# Altium schematic sheet Schematic-sensor.SchDoc
size A4
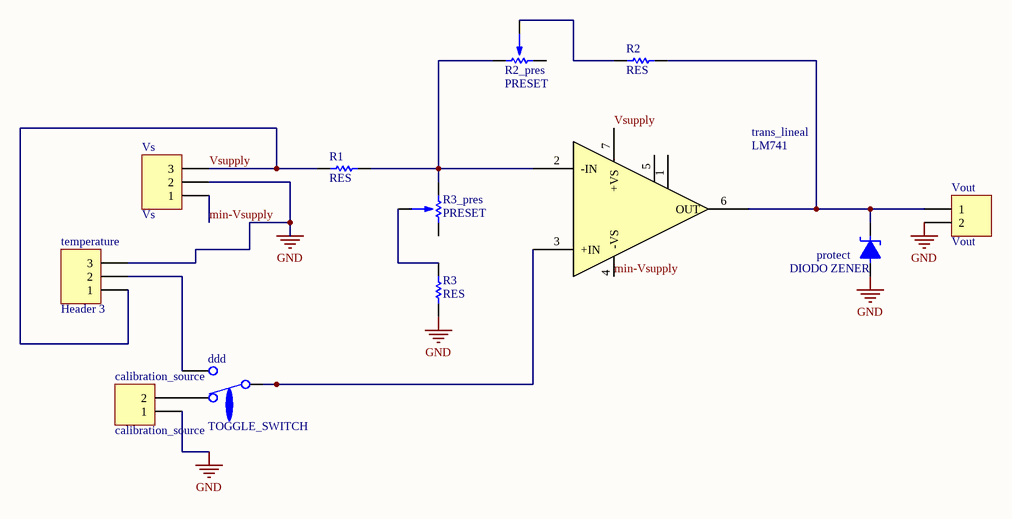
[diagram p0: Schematic-sensor.SchDoc]

## Parts
calibration_source  calibration_source  [HDR1X2]
ddd  TOGGLE_SWITCH  [TOOGLE SWITCH SIMPLE]
protect  DIODO ZENER  [DO41]
R1  RES  [RES400]
R2  RES  [RES400]
R2_pres  PRESET  [PRESET V]
R3  RES  [RES400]
R3_pres  PRESET  [PRESET V]
temperature  Header 3  [HDR1X3]
trans_lineal  LM741  [DIP8]
Vout  Vout  [HDR1X2]
Vs  Vs  [HDR1X3]

## Nets
GND: calibration_source.1 protect.1 R3.1 temperature.3 Vout.2 Vs.2
min-Vsupply: trans_lineal.4(-VS) Vs.1
Vsupply: R1.1 temperature.1 trans_lineal.7(+VS) Vs.3
Netcalibration_source_2: calibration_source.2 ddd.3(NC)
Netddd_1: ddd.1(NA) temperature.2
Netddd_2: ddd.2(C) trans_lineal.3(+IN)
Netprotect_2: protect.2 R2.2 trans_lineal.6(OUT) Vout.1
NetR1_2: R1.2 R2_pres.1 R3_pres.3 trans_lineal.2(-IN)
NetR2_1: R2.1 R2_pres.2
NetR3_2: R3.2 R3_pres.2

Not connected (* = marked no-connect by the designer): R2_pres 3; R3_pres 1; trans_lineal 1(-RG) 5(+RG)

## Library data of the parts
calibration_source Vout = Header 2: Header, 2-Pin; LatestRevisionDate: 17-Jul-2002; LatestRevisionNote: Re-released for DXP Platform.; Publisher: Altium Limited
ddd = TOGGLE_SWITCH: Pulsador con reteción
temperature Vs = Header 3: Header, 3-Pin; LatestRevisionDate: 17-Jul-2002; LatestRevisionNote: Re-released for DXP Platform.; Publisher: Altium Limited
trans_lineal = LM741: LM741 Operational Amplifier